# EasyEDA Pro project mine.eprj

# Schematic Schematic1
Create Date: 2024-06-13; Page Name: P1; Project Name: B站阿熊; Schematic Name: Schematic1; Update Date: 2024-06-14; Company: 嘉立创EDA; Page Size: A4; Version: V1.0
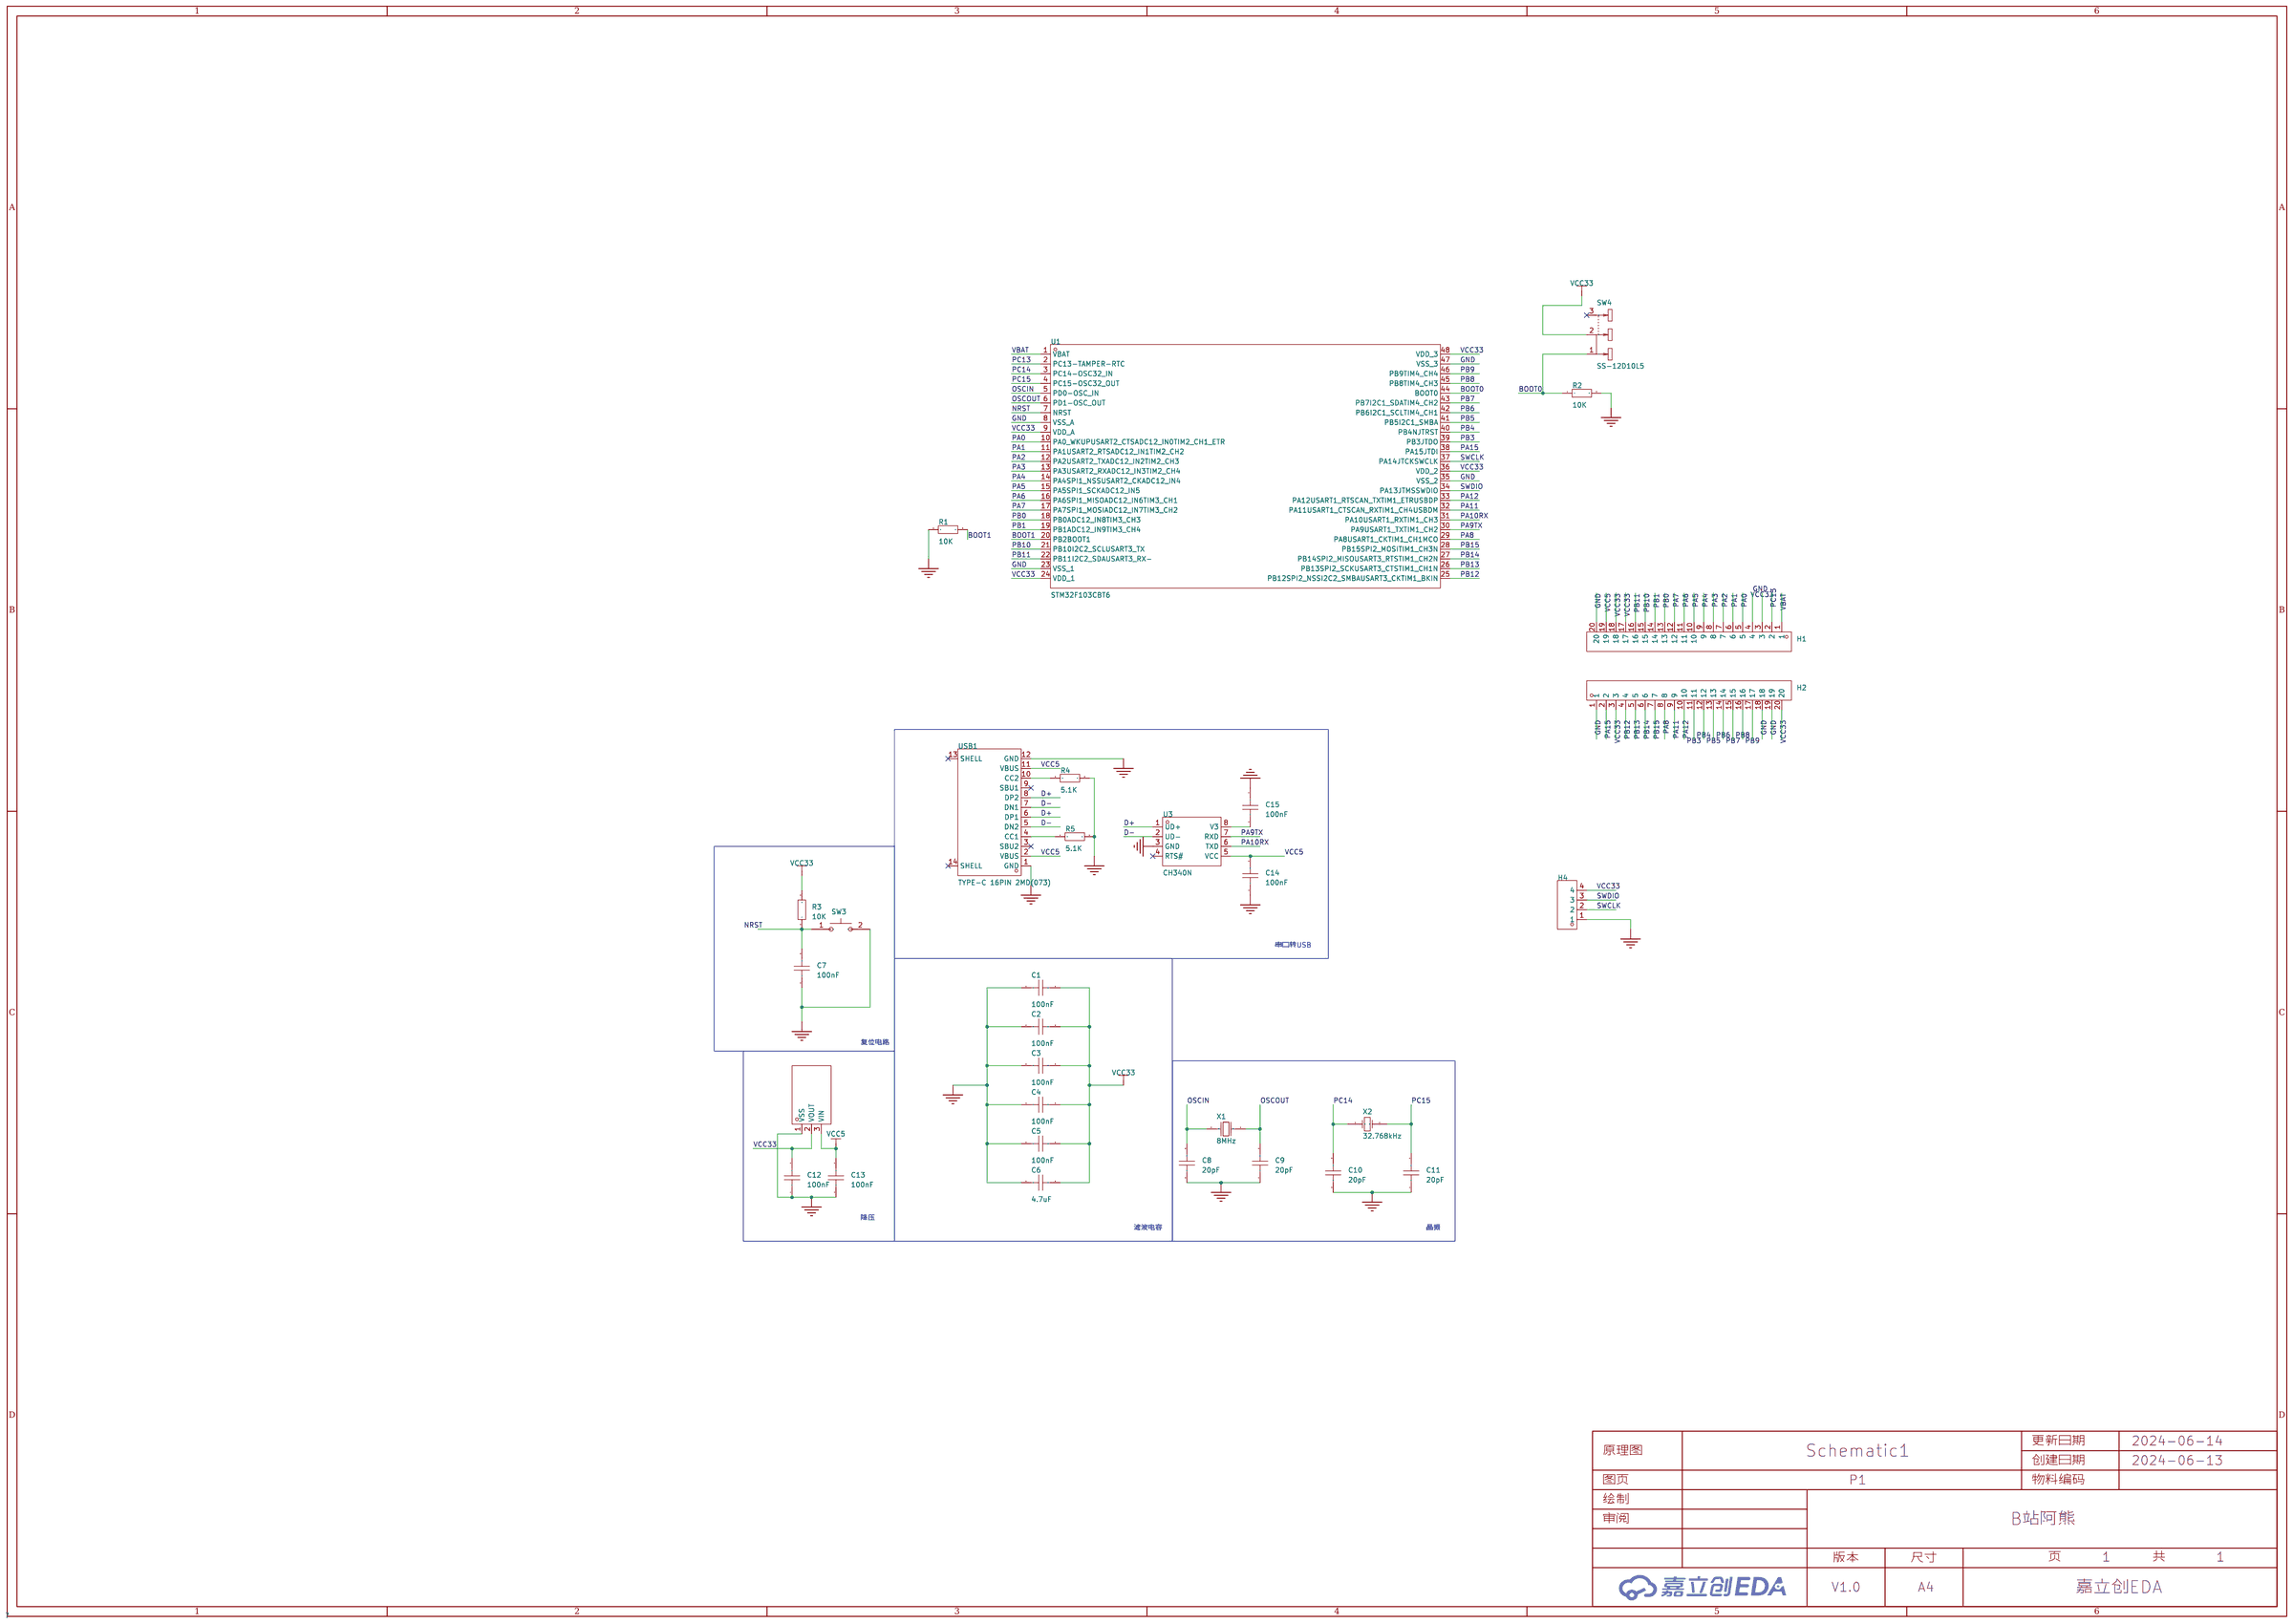
[diagram p0: schematic sheet]

## Parts
C1  100nF  [C0603]
C2  100nF  [C0603]
C3  100nF  [C0603]
C4  100nF  [C0603]
C5  100nF  [C0603]
C6  4.7uF  [C0603]
C7  100nF  [C0603]
C8  20pF  [C0603]
C9  20pF  [C0603]
C10  20pF  [C0603]
C11  20pF  [C0603]
C12  100nF  [C0603]
C13  100nF  [C0603]
C14  100nF  [C0603]
C15  100nF  [C0603]
H1  -  [HDR-TH_20P-P2.54-V-M-1]
H2  -  [HDR-TH_20P-P2.54-V-M-1]
H4  -  [HDR-TH_4P-P2.54-V-M]
R1  10K  [R0603]
R2  10K  [R0603]
R3  10K  [R0603]
R4  5.1K  [R0603]
R5  5.1K  [R0603]
SW3  1TS002C-2300-4300-CT  [SW-SMD_L6.0-W3.5-LS8.0-EH]
SW4  SS-12D10L5  [SW-TH_SS-12D10L5]
U1  STM32F103CBT6  [LQFP-48_L7.0-W7.0-P0.50-LS9.0-BL]
U2  ME6206A33XG  [SOT-23-3_L2.9-W1.6-P1.90-LS2.8-BR]
U3  CH340N  [SOP-8_L4.9-W3.9-P1.27-LS6.0-BL]
USB1  TYPE-C 16PIN 2MD(073)  [USB-C-SMD_TYPE-C-6PIN-2MD-073]
X1  8MHz  [CRYSTAL-SMD_L11.5-W4.8-LS12.7]
X2  32.768kHz  [OSC-TH_BD3.1-P0.8-D0.3]

## Library data of the parts
C1-C15 = CAP_0603: Supplier Footprint: 0603
H1 H2 = HDR-M_2.54_1x20P: 间距:2.54mm;总PIN位数:20;排数:1;插针结构:-;行距:-;安装类型:直插;圆针/方针:-;额定电流:-;额定电压:-;配合针长度:-;塑高:-;触头材质:黄铜;触头镀层:-;颜色:黑色;; Supplier Part: C50981; Supplier Footprint: 插件
H4 = HDR-M_2.54_1x4P: Supplier Part: C492403; Supplier Footprint: 插件
R1-R5 = Res_0603: Supplier Footprint: 0603
SW3 = 1TS002C-2300-4300-CT: 电路结构:单刀单掷;按钮形状:矩形按钮;作用力:230gf;安装方式:立贴;开关长度:6mm;开关宽度:3.5mm;开关高度:4.3mm;带支架:不带;触点电流:50mA;额定电压(DC):12V;额定功率:0.6W;绝缘电阻:100MΩ;带灯:无;机械寿命:3万次;; LCSC Part Name: 6*3.5*4.3mm 立贴 轻触开关; Supplier Part: C319340; Manufacturer: HYP(鸿源精密); Supplier Footprint: SMD,3.5x6mm; Datasheet: https://atta.szlcsc.com/upload/public/pdf/source/20181106/C319340_6D4557880F4EAE8D4DD4D90C9114405F.pdf; Supplier: LCSC; Circuit: 单刀单掷; Actuator Style: 矩形按钮; Operating Force: 230gf; Mounting Style: 立贴; Switch Length: 6mm; Switch Width: 3.5mm; Switch Height: 4.3mm; Strike Gundam: 不带; Contact Current: 50mA; Voltage Rating (DC): 12V; Power Rating: 0.6W; Insulation Resistance: 100MΩ; Actuator/Cap Color: 白色; With Lamp: 无; Pin Style: 鸥翼型; Mechanical Life: 3万次; Operating Temperature: -40℃~+90℃
SW4 = SS-12D10L5: 电路结构:单刀双掷;安装方式:直插;开关颜色:黑色;额定电流(DC):3A;额定电压(DC):125V;额定电流(AC):3A;额定电压(AC):125V;机械寿命:1万次;; LCSC Part Name: 柄长5mm 直插双档 滑动开关; Supplier Part: C319012; Manufacturer: XKB Connectivity(中国星坤); Supplier Footprint: 插件; Datasheet: https://atta.szlcsc.com/upload/public/pdf/source/20211009/D6412F37AABE6F9459A6EE7FA4DAEADB.pdf; Supplier: LCSC; Circuit: 单刀双掷; Actuator Style: 矩形柱状; Pin Style: PC引脚; Switch Length: 13mm; Switch Width: 6.8mm; Switch Height: 6.4mm; Mounting Style: 直插; Actuator Color: 黑色; Current Rating (DC): 3A; Voltage Rating (DC): 125V; Current Rating (AC): 3A; Voltage Rating (AC): 125V; Mechanical Life: 1万次; Operating Temperature: -40℃~+85℃
U1 = STM32F103CBT6: CPU内核:CM3;程序存储容量:128KB;RAM总容量:20KB;GPIO端口数量:37;工作电压范围:2V~3.6V;CPU最大主频:72MHz;程序存储器类型:FLASH;; Supplier Part: C8304; Manufacturer: ST(意法半导体); Supplier Footprint: LQFP-48(7x7); Datasheet: https://atta.szlcsc.com/upload/public/pdf/source/20150811/1457707344439.pdf; Supplier: LCSC; CPU Core: CM3; Program Storage Size: 128KB; RAM Size: 20KB; GPIO Ports Number: 37; Operating Voltage Range: 2V~3.6V; CPU Maximum Speed: 72MHz; Program Memory Type: FLASH; Operating Temperature Range: -40℃~+85℃; ADC (Bit): 12bit; Universal Serial Bus: 有; Peripheral/Function: DMA；片载温度传感器；PWM; Watchdog: 有; Infrared Data Association: 有; Low-Voltage Detect: 有; Direct Memory Access: 有; Internal Oscillator: 有
U2 = ME6206A33XG: 输出类型:固定;最大输入电压:6V;输出电压:3.3V;最大输出电流:300mA;电源纹波抑制比(PSRR):50dB@(1kHz);输出极性:正极;; LCSC Part Name: 输入6V 输出3.3V 300mA; Supplier Part: C161345; Manufacturer: MICRONE(南京微盟); Supplier Footprint: SOT-23; Datasheet: https://atta.szlcsc.com/upload/public/pdf/source/20180207/C161345_15179949863651359188.pdf; Supplier: LCSC; Output Type: 固定; Maximum Input Voltage: 6V; Output Voltage: 3.3V; MAX Output Current: 300mA; Power Supply Rejection Ratio (PSRR): 50dB@(1kHz); Dropout Voltage: 400mV@(200mA); Output Polarity: 正极; Number of Outputs: 1
U3 = CH340N: LCSC Part Name: USB转串口芯片 CH340; Supplier Part: C2977777; Manufacturer: WCH(南京沁恒); Supplier Footprint: SOP-8; Datasheet: https://atta.szlcsc.com/upload/public/pdf/source/20230530/6E401E9554E9F5311886CC8B3F89B62E.pdf; Supplier: LCSC
USB1 = TYPE-C 16PIN 2MD(073): 连接器类型:Type-C;标准:-;公母:母;端口数量:1;触点数量:16P;安装方式:卧贴;额定电流 - 电源:5A;工作温度范围:-25℃~+85℃;; LCSC Part Name: Type-C 母 卧贴; Supplier Part: C2765186; Manufacturer: SHOU HAN(首韩); Supplier Footprint: SMD; Datasheet: https://atta.szlcsc.com/upload/public/pdf/source/20211123/39B17C16241EAC15C5E277BDA434118E.pdf; Supplier: LCSC; Connector Type: Type-C; Gender: 母; Number of Ports: 1; Number of Contacts: 16P; Mounting Style: 卧贴; Current Rating - Power (Max): 5A; Operating Temperature Range: -25℃~+85℃
X1 = X49SM8MSD2SC: 晶振类型:贴片晶振;频率:8MHz;常温频差:±20ppm;外接负载电容:20pF;频率稳定度(全温):±30ppm;; LCSC Part Name: 8MHz ±20ppm 20pF; Supplier Part: C12674; Manufacturer: YXC(扬兴晶振); Supplier Footprint: HC-49S-SMD; Datasheet: https://atta.szlcsc.com/upload/public/pdf/source/20240329/3EBF42EBCAB50CA65B6FA9D7CFA1955A.pdf; Supplier: LCSC; Crystal Type: 贴片晶振; Normal temperature Frequency Tolerance: ±20ppm; External load capacitor: 20pF; Frequency Stability(Full temperature range): ±30ppm; Operating Temperature: -20℃~+70℃
X2 = X308032768KGB2SC: 晶振类型:直插晶振;频率:32.768kHz;常温频差:±10ppm;外接负载电容:12.5pF;频率稳定度(全温):-;; LCSC Part Name: 32.768kHz ±10ppm 12.5pF YT-38; Supplier Part: C52082; Manufacturer: YXC(扬兴晶振); Supplier Footprint: DT-38; Datasheet: https://atta.szlcsc.com/upload/public/pdf/source/20240329/231E1A1EB7C875CD193DBE6664A3DE3A.pdf; Supplier: LCSC; Crystal Type: 直插晶振; Normal temperature Frequency Tolerance: ±10ppm; External load capacitor: 12.5pF; Operating Temperature: -20℃~+70℃

## Nets
GND: C1.1 C2.1 C3.1 C4.1 C5.1 C6.1 C7.1 C8.1 C9.1 C10.1 C11.1 C12.1 C13.1 C14.1 C15.1 H1.4 H1.20 H2.1 H2.18 H2.19 H4.1 R1.1 R2.2 R4.2 R5.2 SW3.2(B) U1.8(VSS_A) U1.23(VSS_1) U1.35(VSS_2) U1.47(VSS_3) U2.1(VSS) U3.3(GND) USB1.1(GND) USB1.12(GND)
VBAT: H1.1 U1.1(VBAT)
VCC5: C13.2 C14.2 H1.19 U2.3(VIN) U3.5(VCC) USB1.2(VBUS) USB1.11(VBUS)
VCC33: C1.2 C2.2 C3.2 C4.2 C5.2 C6.2 C12.2 H1.3 H1.17 H1.18 H2.3 H2.20 H4.4 R3.2 SW4.2 U1.9(VDD_A) U1.24(VDD_1) U1.36(VDD_2) U1.48(VDD_3) U2.2(VOUT)
BOOT0: R2.1 SW4.1 U1.44(BOOT0)
BOOT1: R1.2 U1.20(PB2BOOT1)
D+: U3.1(UD+) USB1.6(DP1) USB1.8(DP2)
D-: U3.2(UD-) USB1.5(DN2) USB1.7(DN1)
NRST: C7.2 R3.1 SW3.1(A) U1.7(NRST)
OSCIN: C8.2 U1.5(PD0-OSC_IN) X1.2(OSC2)
OSCOUT: C9.2 U1.6(PD1-OSC_OUT) X1.1(OSC1)
PA0: H1.5 U1.10(PA0_WKUPUSART2_CTSADC12_IN0TIM2_CH1_ETR)
PA1: H1.6 U1.11(PA1USART2_RTSADC12_IN1TIM2_CH2)
PA2: H1.7 U1.12(PA2USART2_TXADC12_IN2TIM2_CH3)
PA3: H1.8 U1.13(PA3USART2_RXADC12_IN3TIM2_CH4)
PA4: H1.9 U1.14(PA4SPI1_NSSUSART2_CKADC12_IN4)
PA5: H1.10 U1.15(PA5SPI1_SCKADC12_IN5)
PA6: H1.11 U1.16(PA6SPI1_MISOADC12_IN6TIM3_CH1)
PA7: H1.12 U1.17(PA7SPI1_MOSIADC12_IN7TIM3_CH2)
PA8: H2.8 U1.29(PA8USART1_CKTIM1_CH1MCO)
PA9TX: U1.30(PA9USART1_TXTIM1_CH2) U3.7(RXD)
PA10RX: U1.31(PA10USART1_RXTIM1_CH3) U3.6(TXD)
PA11: H2.9 U1.32(PA11USART1_CTSCAN_RXTIM1_CH4USBDM)
PA12: H2.10 U1.33(PA12USART1_RTSCAN_TXTIM1_ETRUSBDP)
PA15: H2.2 U1.38(PA15JTDI)
PB0: H1.13 U1.18(PB0ADC12_IN8TIM3_CH3)
PB1: H1.14 U1.19(PB1ADC12_IN9TIM3_CH4)
PB3: H2.11 U1.39(PB3JTDO)
PB4: H2.12 U1.40(PB4NJTRST)
PB5: H2.13 U1.41(PB5I2C1_SMBA)
PB6: H2.14 U1.42(PB6I2C1_SCLTIM4_CH1)
PB7: H2.15 U1.43(PB7I2C1_SDATIM4_CH2)
PB8: H2.16 U1.45(PB8TIM4_CH3)
PB9: H2.17 U1.46(PB9TIM4_CH4)
PB10: H1.15 U1.21(PB10I2C2_SCLUSART3_TX)
PB11: H1.16 U1.22(PB11I2C2_SDAUSART3_RX-)
PB12: H2.4 U1.25(PB12SPI2_NSSI2C2_SMBAUSART3_CKTIM1_BKIN)
PB13: H2.5 U1.26(PB13SPI2_SCKUSART3_CTSTIM1_CH1N)
PB14: H2.6 U1.27(PB14SPI2_MISOUSART3_RTSTIM1_CH2N)
PB15: H2.7 U1.28(PB15SPI2_MOSITIM1_CH3N)
PC13: H1.2 U1.2(PC13-TAMPER-RTC)
PC14: C10.2 U1.3(PC14-OSC32_IN) X2.1(OSC1)
PC15: C11.2 U1.4(PC15-OSC32_OUT) X2.2(OSC2)
SWCLK: H4.2 U1.37(PA14JTCKSWCLK)
SWDIO: H4.3 U1.34(PA13JTMSSWDIO)
$1N3741: C15.2 U3.8(V3)
$1N4049: R4.1 USB1.10(CC2)
$1N4133: R5.1 USB1.4(CC1)

Not connected (* = marked no-connect by the designer): SW4 3*; U3 4(RTS#)*; USB1 3(SBU2)* 9(SBU1)* 13(SHELL)* 14(SHELL)*

## Notes on the sheet
- 串口转USB
- 复位电路
- 降压
- 滤波电容
- 晶振

# Board PCB1
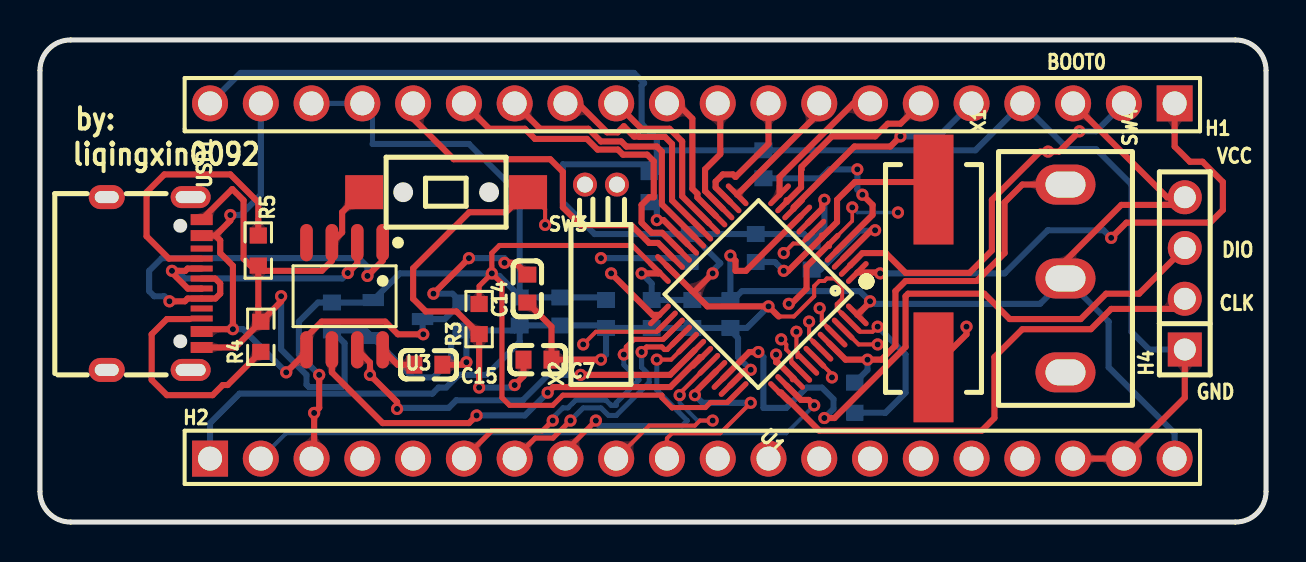
[diagram p1: board, top side]
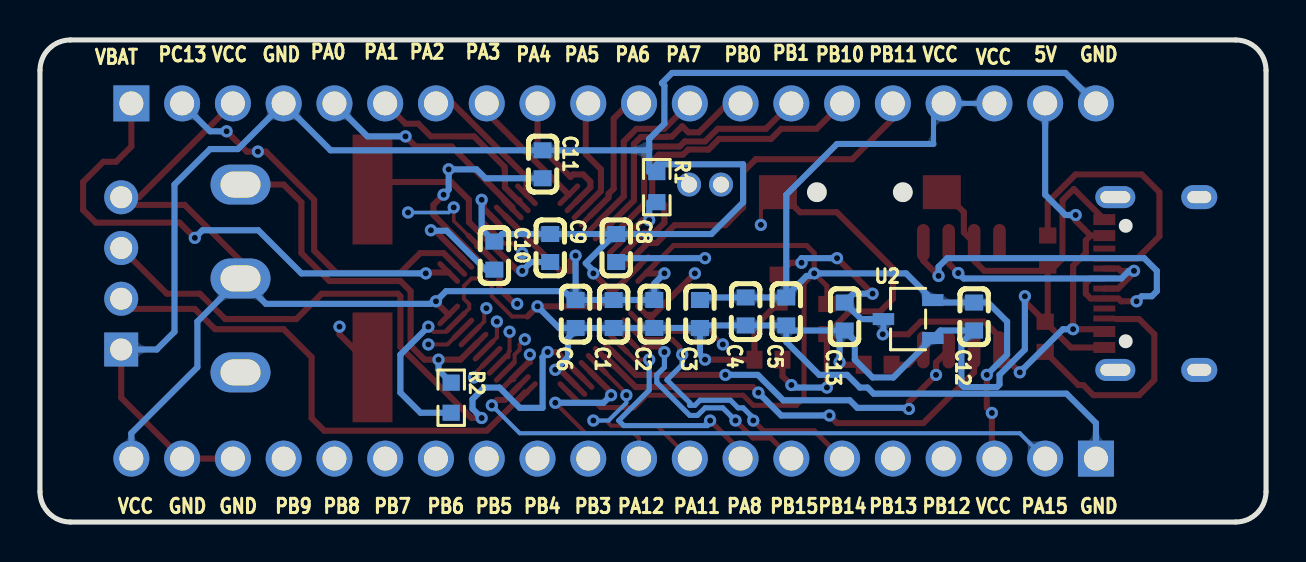
[diagram p2: board, bottom side, seen from below]

Outline 61.34 x 24.13 mm; copper layers: Top Layer, Inner1, Inner2, Bottom Layer. Coordinates in mm from the lower left corner of the outline.
Outline path: 0,22.61 0,1.52 arc(0.45,0.45) 1.52,0 59.82,0 arc(60.89,0.45) 61.34,1.52 61.34,22.61 arc(60.89,23.68) 59.82,24.13 1.52,24.13 arc(0.45,23.68) 0,22.61
Stack: Top Layer 0.035mm 外层铜厚1oz / Dielectric1 0.2104mm 7628 RC49% 8.6mil / Inner1 0.0152mm 内层铜厚 / Dielectric2 1.065mm 1.1mm H/HOZ 含铜 / Inner2 0.0152mm 内层铜厚 / Dielectric3 0.2104mm 7628 RC49% 8.6mil / Bottom Layer 0.035mm 外层铜厚1oz

## Design rules (mm)
template: JLCPCB Capability(Two Layers Board)
spacing copperThickness1oz (default): track to track 0.102, other pairs 0.152 to 0.3
spacing copperThickness2oz: track to track 0.203, other pairs 0.152 to 0.3
track width copperThickness1oz (default): min 0.127, default 0.254, max 2.54
track width copperThickness2oz: min 0.203, default 0.254, max 2.54
differential pair differentialPair (default): width min 0.127, default 0.254, max 2.54; gap min 0.152, default 0.152
via viaSize (default): diameter min 0.5, default 0.61, max 10; hole min 0.3, default 0.305, max 6.3

## Placement (name value [footprint] x y rotation side)
C1  100nF  [C0603]  32.64 10.41 90 bottom
C2  100nF  [C0603]  30.61 10.41 90 bottom
C3  100nF  [C0603]  28.32 10.41 90 bottom
C4  100nF  [C0603]  26.03 10.54 90 bottom
C5  100nF  [C0603]  24 10.54 90 bottom
C6  4.7uF  [C0603]  34.54 10.41 90 bottom
C7  100nF  [C0603]  24.89 8.13 180 top
C8  20pF  [C0603]  32.51 13.72 270 bottom
C9  20pF  [C0603]  35.81 13.72 270 bottom
C10  20pF  [C0603]  38.61 13.33 270 bottom
C11  20pF  [C0603]  36.19 17.91 270 bottom
C12  100nF  [C0603]  14.6 10.29 90 bottom
C13  100nF  [C0603]  21.08 10.29 90 bottom
C14  100nF  [C0603]  24.38 11.68 90 top
C15  100nF  [C0603]  19.43 7.87 180 top
H1  -  [HDR-TH_20P-P2.54-V-M-1]  32.64 20.95 180 top
H2  -  [HDR-TH_20P-P2.54-V-M-1]  32.64 3.17 0 top
H4  -  [HDR-TH_4P-P2.54-V-M]  57.28 12.45 90 top
R1  10K  [R0603]  30.48 16.76 270 bottom
R2  10K  [R0603]  40.77 6.22 270 bottom
R3  10K  [R0603]  21.97 10.16 90 top
R4  5.1K  [R0603]  11.05 9.27 90 top
R5  5.1K  [R0603]  10.92 13.59 270 top
SW3  1TS002C-2300-4300-CT  [SW-SMD_L6.0-W3.5-LS8.0-EH]  20.32 16.51 180 top
SW4  SS-12D10L5  [SW-TH_SS-12D10L5]  51.31 12.19 270 top
U1  STM32F103CBT6  [LQFP-48_L7.0-W7.0-P0.50-LS9.0-BL]  35.94 11.43 135 top
U2  ME6206A33XG  [SOT-23-3_L2.9-W1.6-P1.90-LS2.8-BR]  17.91 10.16 180 bottom
U3  CH340N  [SOP-8_L4.9-W3.9-P1.27-LS6.0-BL]  15.24 11.3 180 top
USB1  TYPE-C 16PIN 2MD(073)  [USB-C-SMD_TYPE-C-6PIN-2MD-073]  5.72 11.94 270 top
X1  8MHz  [CRYSTAL-SMD_L11.5-W4.8-LS12.7]  44.7 12.19 270 top
X2  32.768kHz  [OSC-TH_BD3.1-P0.8-D0.3]  28.07 16.89 90 top

## Footprints (pads in the part's own frame, mm; a bottom-side part is the same pattern mirrored in y, then rotated)
C0603
  rect 0.8x0.9 smd: 1(-0.7,0) 2(0.7,0)
CRYSTAL-SMD_L11.5-W4.8-LS12.7
  rect 5.5x2 smd: 1(-4.45,0) 2(4.45,0)
HDR-TH_4P-P2.54-V-M
  rect 1.7x1.7 hole 1.1: 1(-3.81,0)
  round 1.7 hole 1.1: 2(-1.27,0) 3(1.27,0) 4(3.81,0)
HDR-TH_20P-P2.54-V-M-1
  rect 1.8x1.8 hole 1.2: 1(-24.13,0)
  round 1.8 hole 1.2: 2(-21.59,0) 3(-19.05,0) 4(-16.51,0) 5(-13.97,0) 6(-11.43,0) 7(-8.89,0) 8(-6.35,0) 9(-3.81,0) 10(-1.27,0) 11(1.27,0) 12(3.81,0) 13(6.35,0) 14(8.89,0) 15(11.43,0) 16(13.97,0) 17(16.51,0) 18(19.05,0) 19(21.59,0) 20(24.13,0)
LQFP-48_L7.0-W7.0-P0.50-LS9.0-BL
  oval 0.27x1.5 smd: 1(-2.75,-4.25) 2(-2.25,-4.25) 3(-1.75,-4.25) 4(-1.25,-4.25) 5(-0.75,-4.25) 6(-0.25,-4.25) 7(0.25,-4.25) 8(0.75,-4.25) 9(1.25,-4.25) 10(1.75,-4.25) 11(2.25,-4.25) 12(2.75,-4.25) 25(2.75,4.25) 26(2.25,4.25) 27(1.75,4.25) 28(1.25,4.25) 29(0.75,4.25) 30(0.25,4.25) 31(-0.25,4.25) 32(-0.75,4.25) 33(-1.25,4.25) 34(-1.75,4.25) 35(-2.25,4.25) 36(-2.75,4.25)
  oval 1.5x0.27 smd: 13(4.25,-2.75) 14(4.25,-2.25) 15(4.25,-1.75) 16(4.25,-1.25) 17(4.25,-0.75) 18(4.25,-0.25) 19(4.25,0.25) 20(4.25,0.75) 21(4.25,1.25) 22(4.25,1.75) 23(4.25,2.25) 24(4.25,2.75) 37(-4.25,2.75) 38(-4.25,2.25) 39(-4.25,1.75) 40(-4.25,1.25) 41(-4.25,0.75) 42(-4.25,0.25) 43(-4.25,-0.25) 44(-4.25,-0.75) 45(-4.25,-1.25) 46(-4.25,-1.75) 47(-4.25,-2.25) 48(-4.25,-2.75)
OSC-TH_BD3.1-P0.8-D0.3
  round 1.2 hole 0.8: 1(0,0.8) 2(0,-0.8)
R0603
  rect 0.806x0.864 smd: 1(-0.753,0) 2(0.753,0)
SOP-8_L4.9-W3.9-P1.27-LS6.0-BL
  oval 0.63x1.865 smd: 1(-1.905,-2.683) 2(-0.635,-2.683) 3(0.635,-2.683) 4(1.905,-2.683) 5(1.905,2.683) 6(0.635,2.683) 7(-0.635,2.683) 8(-1.905,2.683)
SOT-23-3_L2.9-W1.6-P1.90-LS2.8-BR
  rect 1.07x0.6 smd: 1(1.235,-0.95) 2(1.235,0.95) 3(-1.235,0)
SW-SMD_L6.0-W3.5-LS8.0-EH
  rect 1.9x1.7 smd: 1(-4.1,0) 2(4.1,0)
SW-TH_SS-12D10L5
  oval 2x3 hole 1.3x2: 1(-4.7,0) 2(0,0) 3(4.7,0)
USB-C-SMD_TYPE-C-6PIN-2MD-073
  rect 0.55x1.1 smd: 1(-3.2,2.375) 2(-2.4,2.375) 11(2.4,2.375) 12(3.2,2.375)
  rect 0.3x1.1 smd: 3(-1.75,2.375) 4(-1.25,2.375) 5(-0.75,2.375) 6(-0.25,2.375) 7(0.25,2.375) 8(0.75,2.375) 9(1.25,2.375) 10(1.75,2.375)
  oval 1.1x2 hole 0.6x1.5: 13(-4.325,1.825) 14(4.325,1.825)
  oval 1.2x1.8 hole 0.6x1.2: 13(-4.325,-2.375) 14(4.325,-2.375)

## Nets
As in the schematic.

Pads without a net: SW4 3; U3 4; USB1 3 9 13 14

## Via types
v1: diameter 0.61, hole 0.305, Top Layer to Bottom Layer, 72 vias

## Routing (per net, layer and track width the routed paths; a pad name or vN(x,y) marks a point on that pad's centre or on a via; arc(x,y) is an arc through that point)
GND: length 215.2
  Top Layer w0.203: v1(41.91,9.78) 41.66,9.52 41.03,9.52 U1.47 39.87,10.69 39.87,10.91 40.13,11.18 40.13,11.81 39.75,12.19 39.37,12.19 39.24,12.06 38.99,12.06 38.73,11.81 38.73,11.3 37.72,10.29 36.96,10.29
  Top Layer w0.305: 32.63,11.56 32.77,11.56 v1(33.66,12.45) ; 32.63,11.56 33.39,10.8 v1(36.45,10.8) 36.96,10.29 ; 32.63,11.56 U1.23 ; C14.1 25.59,9.78 C7.1 v1(28.07,8.13) ; 38.42,14.97 39.14,15.69 39.14,16.02 v1(39.24,16.13) ; R4.2 9.76,8.74 USB1.12 ; R4.2 12.06,11.04 v1(12.06,11.3) ; R4.2 10.92,10.15 R5.2 ; H4.1 57.28,6.22 H2.19 H2.18 ; v1(35.56,7.62) 35.5,7.56 35.25,7.56 U1.35 ; C15.1 21.21,7.87 v1(21.34,8) ; USB1.1 9.62,16.67 10.19,16.1 10.19,13.18 10.53,12.84 R5.2 ; SW3.2 16.12,16.51 15.12,15.51 15.12,14.5 U3.3 14.6,13.08 14.1,12.57 11.18,12.57 R5.2
  Bottom Layer w0.305: C13.1 21.34,9.33 v1(21.34,8) ; C13.1 20.57,9.08 20.57,8.13 19.69,7.24 18.64,7.24 U2.1 16.29,9.59 C12.1 15.24,8.95 15.24,6.88 15.11,6.76 13.46,6.76 13.34,6.88 13.34,7.37 12.06,8.64 v1(12.06,11.3) ; C13.1 23.75,9.59 C5.1 ; H1.20 10.03,22.48 29.72,22.48 30.23,21.97 30.1,21.84 30.1,19.94 30.86,19.18 30.86,18.63 ; C5.1 24,9.02 22.35,7.37 20.95,7.37 20.32,6.73 19.94,6.73 19.63,6.43 9.98,6.43 8.51,4.95 H2.1 ; C5.1 C4.1 28.19,9.84 C3.1 ; H4.1 55.5,8.64 54.61,9.52 54.61,16.89 52.83,18.67 51.44,18.67 H1.4 46.8,18.61 C11.1 30.88,18.61 30.86,18.63 ; C6.1 35.37,9.71 v1(36.45,10.8) ; 32.57,14.42 C8.1 27.75,14.42 26.16,16 26.16,17.91 30.47,17.91 30.86,17.52 30.86,18.63 ; 32.57,14.42 C9.1 38.23,14.42 C10.1 39.24,14.67 v1(39.24,16.13) ; 32.57,14.42 34.04,12.95 33.66,12.57 v1(33.66,12.45) ; R2.2 42.3,5.47 43.31,6.48 43.31,8.38 v1(41.91,9.78) ; v1(35.56,7.62) 34.93,8.25 34.93,9.21 34.42,9.71 C1.1 C2.1 C3.1 ; C3.1 28.32,8.38 v1(28.07,8.13)
VBAT: length 26.5
  Top Layer w0.305: U1.1 41.91,12.49 41.91,12.45 ; H1.1 56.77,18.8 57.53,18.03 58.17,18.03 59.18,17.02 59.18,15.62 58.55,14.99 54.36,14.99 v1(53.59,14.22)
  Bottom Layer w0.305: v1(53.59,14.22) 53.21,14.61 50.42,14.61 48.26,12.45 v1(42.04,12.45)
VCC5: length 38.2
  Top Layer w0.305: 8.78,14.34 9.02,14.1 9.02,13.46 9.65,12.83 v1(9.65,9.65) 8.2,9.65 USB1.11 ; 8.78,14.34 9.53,15.09 v1(9.53,15.37) ; 8.78,14.34 USB1.2 ; v1(19.18,9.4) 17.91,9.4 17.27,10.03 14.1,10.03 13.34,9.27 U3.5 13.34,8.51 v1(12.32,7.49) ; v1(19.69,11.43) v1(21.46,13.21) ; v1(23.24,12.98) 23.79,12.98 C14.2
  Bottom Layer w0.305: v1(23.24,12.98) 23.24,13.21 v1(21.46,13.21) ; 9.78,9.78 v1(9.65,9.65) 10.16,9.65 v1(12.32,7.49) ; 9.53,15.24 v1(9.53,15.37) 10.03,15.37 11.05,16.38 H1.19 ; v1(19.18,9.4) 19.14,9.43 19.14,10.16 20.25,10.16 C13.2 20.64,11.43 v1(19.69,11.43)
VCC33: length 133.5
  Top Layer w0.254: v1(22.61,12.45) 21.97,11.81 R3.2 ; v1(22.61,12.45) 22.61,13.46 22.99,13.84 29.64,13.84 U1.24 ; v1(22.61,12.45) 23.11,11.94 23.11,6.22 23.5,5.84 25.65,5.84 26.16,6.35 31.12,6.35 31.12,6.22 31.62,5.72 31.64,5.73 33.29,5.73 33.54,5.98 34.38,5.98 U1.36
  Top Layer w0.305: v1(30.1,12.45) 30.95,12.45 U1.24 ; v1(41.53,11.05) 41.53,11.01 U1.48 ; H2.3 13.72,3.3 v1(13.72,5.46) 13.97,5.72 v1(13.97,7.37) ; SW4.2 51.31,13.08 54.1,15.88 56.9,15.88 H4.4 56.39,16.26 H1.3 ; v1(34.54,13.33) 34.8,13.08 34.8,12.57 35.32,12.57 38.06,15.32
  Bottom Layer w0.254: 16.64,18.92 16.64,20.45 H1.17 H1.18 ; 24,11.3 C5.2
  Bottom Layer w0.305: C3.2 28.19,11.24 C4.2 C5.2 ; H2.20 56.77,4.44 53.47,7.75 53.47,10.03 SW4.2 50.04,10.92 41.78,10.92 41.66,11.05 v1(41.53,11.05) 41.02,11.56 35.11,11.56 34.54,10.99 34.42,11.11 C1.2 C2.2 30.61,11.94 v1(30.1,12.45) ; v1(34.54,13.33) C6.2 ; 16.64,18.92 21.46,18.92 24,16.38 24,11.3 22.99,12.32 22.73,12.32 v1(22.61,12.45) 18.01,12.45 U2.2 16.55,10.99 C12.2 13.91,10.99 12.95,10.03 12.95,8.38 v1(13.97,7.37)
BOOT0: length 20.3
  Top Layer w0.305: 39.48,8.95 40.3,8.13 v1(41.4,8.13) 42.1,8.13 42.8,8.83 42.8,11.56 43.31,12.06 46.86,12.06 48.26,13.46 48.26,16 49.15,16.89 SW4.1
  Bottom Layer w0.305: R2.1 41.4,7.61 v1(41.4,8.13)
BOOT1: length 2.9
  Top Layer w0.305: 32.41,13.91 31.2,15.11 v1(30.86,15.11)
  Bottom Layer w0.305: v1(30.86,15.11) 30.86,16.01
D+: length 20.3
  Top Layer w0.305: USB1.6 8.77,12.19 9.02,11.94 9.02,11.43 8.77,11.19 USB1.8 7.39,11.19 7.25,11.05 v1(6.48,11.05) ; v1(16.38,12.32) 17.15,13.08 U3.1
  Bottom Layer w0.305: v1(6.48,11.05) 6.22,11.3 5.72,11.3 5.46,11.56 5.46,12.57 6.1,13.21 15.95,13.21 16.38,12.78 v1(16.38,12.32)
D-: length 14.2
  Top Layer w0.305: USB1.5 7.39,12.69 7.27,12.57 v1(6.6,12.57) 6.6,12.48 7.4,11.68 8.09,11.68 USB1.7 ; U3.2 15.88,12.94 v1(15.4,12.46)
  Bottom Layer w0.305: v1(6.6,12.57) 6.86,12.57 7.24,12.19 15.13,12.19 v1(15.4,12.46)
NRST: length 35.4
  Top Layer w0.203: U1.7 38.1,13.94 37.69,13.94 v1(37.21,13.46) ; v1(25.27,14.87) 25.27,15.66 SW3.1
  Top Layer w0.305: C7.2 24.19,7.3 v1(23.75,6.86) ; v1(21.97,6.73) R3.1 20.84,10.54 19.3,10.54 18.67,11.18 18.67,12.7 21.48,15.51 23.32,15.51 24.32,16.51 SW3.1
  Inner1 w0.203: v1(25.27,14.87) 25.89,14.87 26.67,14.1 36.58,14.1 v1(37.21,13.46)
  Bottom Layer w0.305: v1(23.75,6.86) 23.62,6.73 v1(21.97,6.73)
OSCIN: length 33.3
  Top Layer w0.178: v1(40.64,15.75) 40.64,15.07 39.48,13.91
  Top Layer w0.305: X1.2 46.35,9.39 v1(46.35,9.78) ; 39.48,13.82 39.48,13.91 38.35,12.78 38.35,11.68 37.59,10.92 v1(37.47,10.92)
  Inner1 w0.305: 28.32,13.21 30.73,13.21 31.12,12.83 31.12,12.57 32.13,11.56 36.83,11.56 v1(37.47,10.92) ; v1(42.93,15.49) 46.35,12.06 v1(46.35,9.78)
  Bottom Layer w0.178: v1(40.64,15.75) 40.89,15.49 v1(42.93,15.49)
  Bottom Layer w0.305: C8.2 32.32,13.21 v1(28.07,13.21)
OSCOUT: length 11.8
  Top Layer w0.305: U1.6 39.12,14.34 ; U1.6 39.88,15.01 39.88,16.13 40.77,17.02 44.33,17.02 X1.1 ; U1.6 37.44,12.57 v1(37.21,12.57)
  Bottom Layer w0.305: v1(37.21,12.57) 36.77,13.02 C9.2
PA0: length 11.1
  Top Layer w0.305: U1.10 37.71,15.76 40.75,18.8 42.54,18.8 v1(43.05,19.3)
  Bottom Layer w0.305: H1.5 44.96,19.3 v1(43.05,19.3)
PA1: length 9.4
  Top Layer w0.305: H1.6 43.05,19.94 42.42,19.94 41.78,19.3 39.62,19.3 38.1,17.78 38.1,17.65 38.08,17.63 38.08,16.75 U1.11 37.35,16.11
PA2: length 6.9
  Top Layer w0.305: H1.7 40.69,20.95 37,17.26 U1.12
PA3: length 6.3
  Top Layer w0.305: U1.13 38.99,20.49 H1.8
PA4: length 6.9
  Top Layer w0.305: U1.14 33.8,16.75 33.8,17.04 34.16,17.4 34.67,17.4 34.8,17.27 36.45,18.92 H1.9
PA5: length 6
  Top Layer w0.305: H1.10 34.04,20.83 34.04,18.41 33.27,17.65 33.27,16.57 U1.15
PA6: length 6.9
  Top Layer w0.305: H1.11 31.88,20.95 32.64,20.19 32.64,16.68 32.89,16.43 32.89,16.25 33.82,15.32
PA7: length 8.7
  Top Layer w0.305: 33.47,14.97 32.13,16.3 32.13,19.05 31.5,19.69 30.1,19.69 H1.12
PA8: length 13
  Top Layer w0.203: v1(30.86,8.13) 31.58,8.13 32.41,8.95
  Top Layer w0.254: v1(27.81,5.08) 26.29,3.56 H2.8
  Bottom Layer w0.254: v1(30.86,8.13) 30.86,6.6 32.38,5.08 32.13,4.83 27.94,4.83 27.94,4.95 v1(27.81,5.08)
PA9TX: length 19.6
  Top Layer w0.305: U1.30 31.52,7.37 v1(27.05,7.37) ; U3.7 16.51,7.99 v1(16.51,7.37) 17.87,6.01 v1(17.87,5.66)
  Bottom Layer w0.305: v1(27.05,7.37) 25.43,7.37 24.16,6.1 20.83,6.1 20.45,5.72 18.16,5.72
PA10RX: length 22.1
  Top Layer w0.305: U1.31 33.03,8.25 31.54,6.76 25.68,6.76 v1(25.4,6.48) ; U3.6 14.6,7.49 17.15,4.95 21.46,4.95 v1(21.84,5.33)
  Bottom Layer w0.305: v1(21.84,5.33) 24.26,5.33 v1(25.4,6.48)
PA11: length 10.2
  Top Layer w0.203: H2.9 30.48,4.83 32.77,4.83 33.02,5.08 v1(33.66,5.08) ; 33.47,7.89 32,6.43 v1(32,6.35)
  Bottom Layer w0.203: v1(33.66,5.08) 32.89,5.08 32,5.97 v1(32,6.35)
PA12: length 10.5
  Top Layer w0.203: v1(35.56,5.97) 34.04,4.44 31.62,4.44 31.37,4.19 H2.10
  Top Layer w0.305: v1(32.77,6.35) 32.77,6.49 33.82,7.54
  Bottom Layer w0.305: v1(32.77,6.35) 33.15,5.97 v1(35.56,5.97)
PA15: length 30.4
  Top Layer w0.305: v1(38.73,5.84) 38.47,6.11 38.08,6.11 U1.38
  Bottom Layer w0.203: 38.61,5.72 37.34,4.44 12.32,4.44 H2.2
PB0: length 11.4
  Top Layer w0.305: U1.18 31.62,16.1 31.62,18.92 31.27,19.28 30,19.28 29.98,19.3 29.73,19.3 29.21,19.81 28.91,19.51 28.37,19.51 26.92,20.95 H1.13
PB1: length 13.3
  Top Layer w0.305: U1.19 31.12,15.9 31.12,18.54 30.86,18.8 29.34,18.8 29.08,19.05 28.07,19.05 27.43,19.69 25.02,19.69 H1.14
PB3: length 8.4
  Top Layer w0.305: v1(36.83,8.38) 36.83,8 36.9,8 U1.39 37.67,7.14
  Inner1 w0.305: H2.11 34.54,3.17 36.19,4.83 36.19,7.75 v1(36.83,8.38)
PB4: length 8.7
  Top Layer w0.203: 38.06,7.54 37.59,8.01 37.59,8.38 37.34,8.64 37.34,8.89 v1(37.08,9.14)
  Inner1 w0.203: v1(37.08,9.14) 37.62,8.61 37.62,7.77 36.55,6.71 36.55,4.68 36.45,4.58 H2.12
PB5: length 8.1
  Top Layer w0.203: v1(37.85,9.52) 37.85,8.55 37.9,8.51 37.9,8.26
  Inner1 w0.203: v1(37.85,9.52) 37.97,9.4 37.97,4.19 H2.13
PB6: length 6.2
  Top Layer w0.203: U1.42 39.62,7.39 v1(39.62,7.24)
  Inner1 w0.203: H2.14 41.53,5.33 v1(39.62,7.24)
PB7: length 10.9
  Top Layer w0.203: U1.43 38.48,9.24 v1(38.48,10.03)
  Inner1 w0.203: H2.15 44.07,3.68 40.39,7.37 40.39,8.13 v1(38.48,10.03)
PB8: length 13.1
  Top Layer w0.203: v1(39.01,10.7) 39.12,10.59 39.12,10.03 39.83,9.32 39.83,9.31
  Inner1 w0.203: v1(39.01,10.7) 40.64,9.07 40.64,8.3 40.69,8.25 40.69,7.95 41.1,7.54 41.73,7.54 45.21,4.06 45.72,4.06 H2.16
PB9: length 11.7
  Top Layer w0.203: v1(41.91,8.89) 40.96,8.89 U1.46
  Inner1 w0.203: H2.17 48.64,3.17 46.86,4.95 45.85,4.95 v1(41.91,8.89)
PB10: length 16.7
  Top Layer w0.305: 32.05,13.55 31.13,14.48 30.61,14.48 30.1,14.99 30.1,15.88 30.48,16.26 30.71,16.26 30.71,18.06 30.38,18.39 29.17,18.39 28.91,18.64 27.9,18.64 27.36,19.18 24.76,19.18 24.26,19.69 22.48,19.69 H1.15
PB11: length 17.7
  Top Layer w0.305: U1.22 30.93,13.97 30.48,13.97 29.59,14.86 27.05,14.86 26.16,15.75 26.16,17.53 25.53,18.16 20.7,18.16 18.67,20.19 H1.16
PB12: length 19.4
  Top Layer w0.305: U1.25 30.65,10.37 v1(28.57,12.45)
  Inner1 w0.305: H2.4 16.89,3.17 21.08,7.37 22.22,7.37 27.31,12.45 28.45,12.45
PB13: length 15.5
  Top Layer w0.203: v1(27.18,8.89) 27.81,9.52 30.85,9.52 U1.26
  Inner1 w0.203: v1(27.18,8.89) 26.67,8.89 23.93,6.15 21.64,6.15 H2.5
PB14: length 15.4
  Top Layer w0.254: H2.6 22.61,4.57 25.15,4.57 v1(25.65,5.08) ; 29.34,8.51 29.34,8.76 29.72,9.14 31.18,9.14 U1.27
  Bottom Layer w0.254: v1(29.21,8.38) 29.21,7.87 29.97,7.11 28.83,5.97 28.83,5.84 28.57,5.84 28.32,6.1 26.8,6.1 26.42,5.72 26.16,5.72 25.78,5.33 25.78,4.95
PB15: length 12.8
  Top Layer w0.254: v1(30.1,8.51) 30.35,8.76 31.12,8.76 31.24,8.64 31.38,8.64 32.05,9.31 ; v1(26.54,5.08) 25.66,4.2 24.78,4.2 H2.7
  Bottom Layer w0.254: 26.54,4.95 v1(26.54,5.08) 27.18,5.72 28.07,5.72 28.45,5.33 28.83,5.33 30.48,6.98 30.48,7.37 30.1,7.75 v1(30.1,8.51)
PC13: length 19.4
  Top Layer w0.305: v1(52,19.56) 50.99,18.54 v1(50.44,18.54) 50.04,18.54 47.62,16.13 47.62,13.59 46.51,12.47 43.31,12.47 42.32,13.46 41.15,13.46 40.54,12.85 U1.2
  Bottom Layer w0.305: H1.2 52.83,19.56 v1(52,19.56)
PC14: length 22.6
  Top Layer w0.305: v1(41.78,14.61) 41.59,14.61 U1.3
  Inner1 w0.305: X2.1 28.07,16.09 28.07,15.62 28.45,15.24 29.59,15.24 29.59,15.37 30.23,16 38.23,16 39.62,14.61 v1(41.78,14.61)
  Bottom Layer w0.305: v1(41.78,14.61) 41.76,14.58 41,14.58 39.05,12.63 C10.2
PC15: length 22.4
  Top Layer w0.305: v1(41.15,16.38) 41.66,15.88 41.66,15.38 39.83,13.55
  Inner1 w0.305: X2.2 40.13,16.89 v1(40.89,17.65)
  Bottom Layer w0.305: C11.2 39.05,17.21 39.5,17.65 v1(40.89,17.65) 40.89,16.64 v1(41.15,16.38)
SWCLK: length 25.6
  Top Layer w0.305: H4.2 56.77,10.67 53.59,10.67 52.58,9.65 49.15,9.65 47.75,8.25 47.75,5.21 47.12,4.57 38.99,4.57 37.08,6.48 U1.37
SWDIO: length 34.6
  Top Layer w0.305: v1(35.94,8.51) 35.5,8.51 U1.34 ; v1(39.24,5.21) 39.75,5.21 43.31,8.76 43.31,11.3 43.43,11.43 47.24,11.43 48.51,10.16 52.07,10.16 53.34,11.43 54.99,11.43 H4.3
  Bottom Layer w0.305: v1(39.24,5.21) 39.7,5.66 39.7,6.15 39.12,6.73 38.35,6.73 37.34,5.72 36.19,5.72 36.19,8.25 v1(35.94,8.51)
$1N3741: length 1.9
  Top Layer w0.305: C15.2 17.89,7.87 U3.8
$1N4049: length 11.2
  Top Layer w0.305: R4.1 9.39,6.86 9.14,6.86 8.64,6.35 6.35,6.35 5.59,7.11 5.59,9.4 6.35,10.16 7.49,10.16
$1N4133: length 13.6
  Top Layer w0.305: R5.1 10.92,16 9.53,17.4 6.22,17.4 5.33,16.51 5.33,14.3 6.45,13.19 USB1.4

## Copper pours and planes (outline as drawn; the poured copper is in the pictures)
GND on Top Layer: 3.17,25.65 65.91,25.65 65.91,-0.13 3.17,-0.13

Small or netless copper shapes (teardrops, artwork), in the pictures only: 122 on Top Layer, 115 on Bottom Layer

## Text on the board
Bottom Silkscreen Layer: GND | 5V | PA15 | VCC | PB12 | PB11 | PB13 | PB14 | PB10 | PB1 | PB15 | PA8 | PB0 | PA11 | PA7 | PA12 | PA6 | PB3 | PA5 | PB4 | PA4 | PB5 | PA3 | PB6 | PA2 | PB7 | PA1 | PB8 | PA0 | PB9 | PC13 | VBAT
Top Silkscreen Layer: BOOT0 | GND | VCC | CLK | DIO | liqingxin0092 | by:
